# Altium schematic sheet 1A20J4_1A21J8 A.SchDoc: Cable Assembly
size A; Date: 1/1/17; CompanyName: National Center for Atmospheric Research; DrawnBy: Rich Erickson; Engineer: 4/21/17; Organization: Earth Observing Laboratory; Address1: 3450 Mitchell Lane; Address2: FL1; Address3: 3090 Center Green Dr.; Address4: Boulder, CO. 80301; DocumentNumber: 1A20J4_1A21J8(H-CH IF); Revision: A; SheetNumber: 1; SheetTotal: 1; Department: Remote Sensing Facility; ModifiedDate: 7/17/97; ImagePath: 4/21/17; ProjectName: Ka Band; Application_BuildNumber: 5
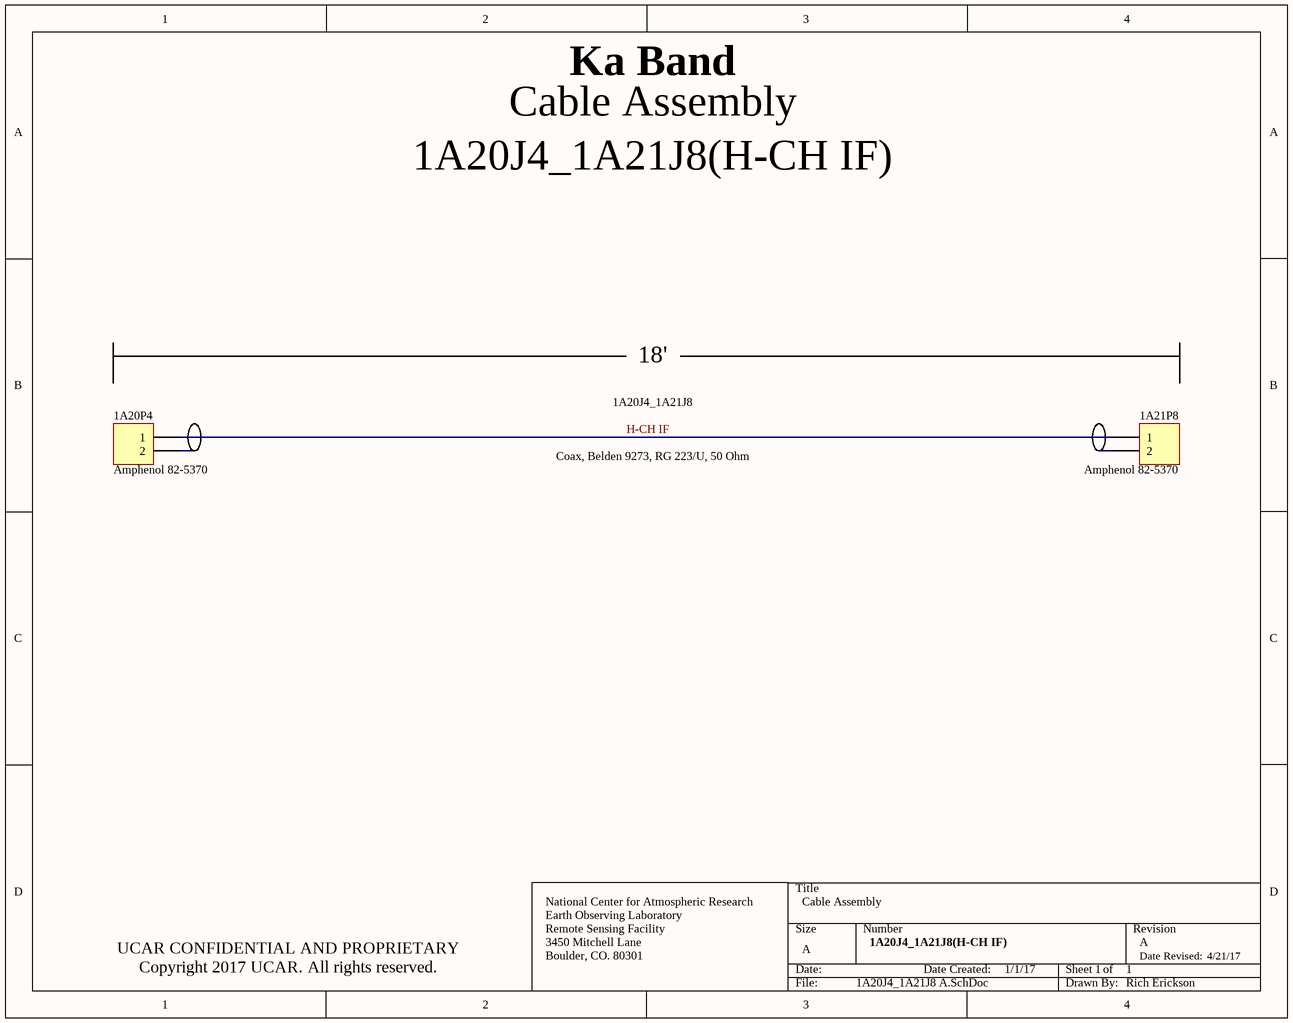
[diagram p0: 1A20J4_1A21J8 A.SchDoc]

## Parts
1A20P4  Amphenol 82-5370  [HDR1X2]
1A21P8  Amphenol 82-5370  [HDR1X2]

## Nets
H-CH IF: 1A20P4.1 1A21P8.1

Not connected (* = marked no-connect by the designer): 1A20P4 2; 1A21P8 2

## Notes on the sheet
- 18'
- 1A20J4_1A21J8
- Coax, Belden 9273, RG 223/U, 50 Ohm
- UCAR CONFIDENTIAL AND PROPRIETARY
  Copyright 2017 UCAR. All rights reserved.
- Date Created:
- Date Revised:

## Library data of the parts
1A20P4 1A21P8 = Header 2: Header, 2-Pin; LatestRevisionDate: 17-Jul-2002; LatestRevisionNote: Re-released for DXP Platform.; Publisher: Altium Limited